# Altium schematic sheet CarrierConnector.SchDoc
size A4; CompanyName: Technische Hochschule Nürnberg Georg Simon Ohm; Organization: UltraZohm; Address1: Kesslerplatz 12; Address2: 90489 Nürnberg; Address3: GERMANY; DocumentNumber: 2; SheetNumber: 2; SheetTotal: 5; Website: www.ultrazohm.com
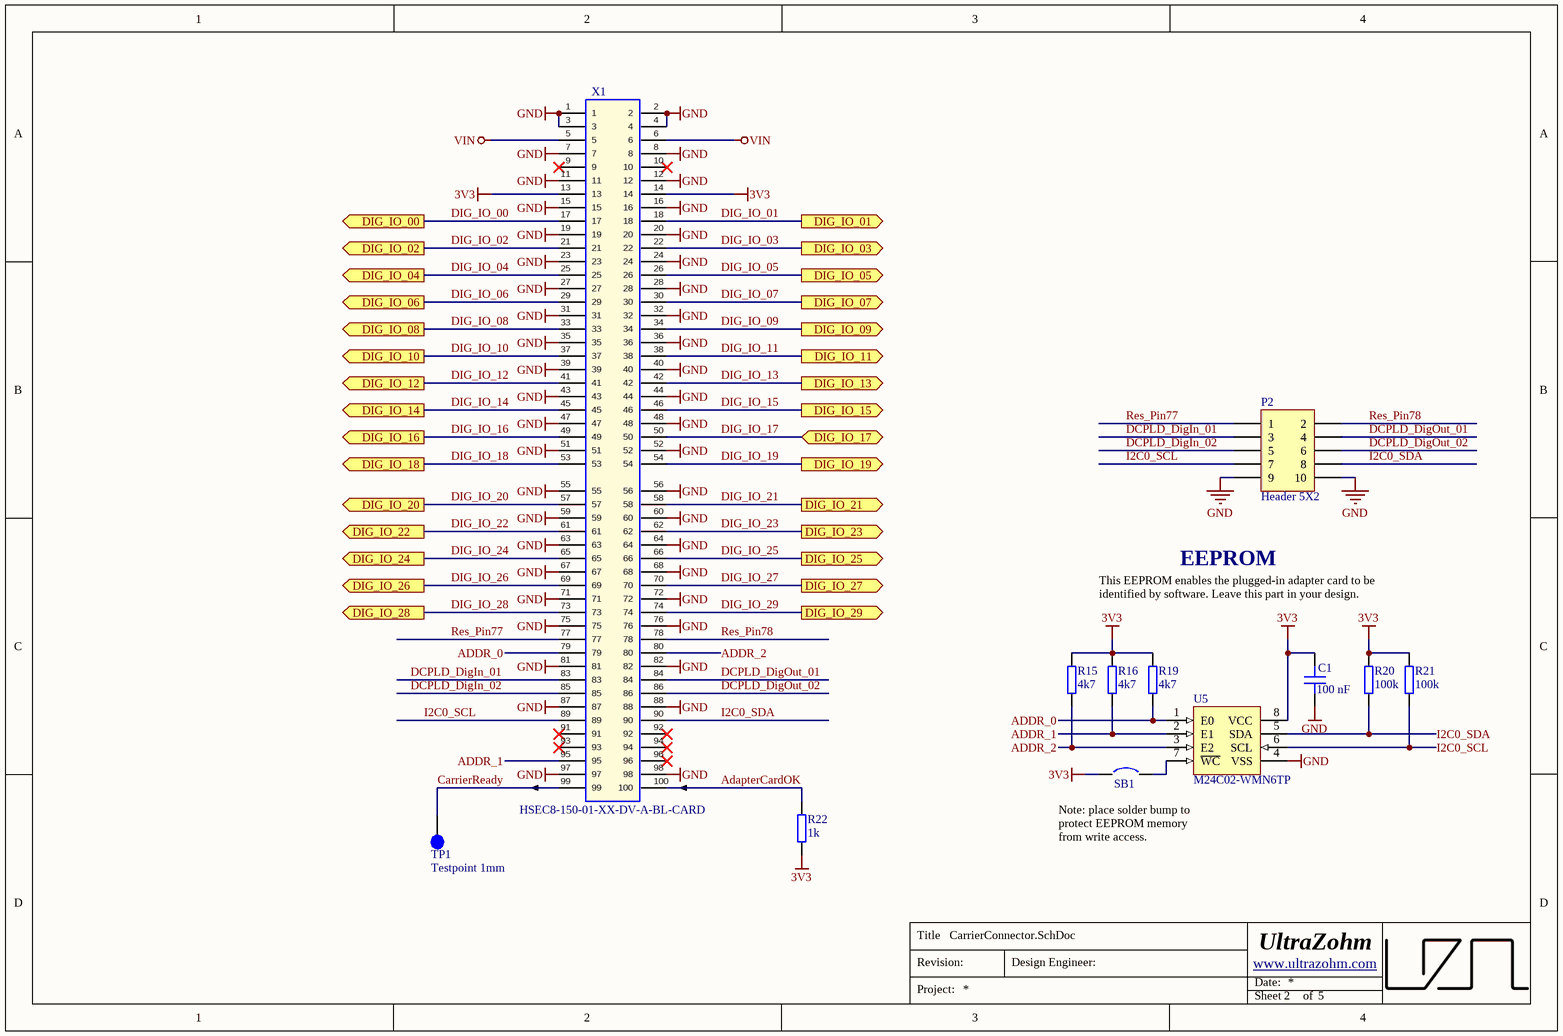
[diagram p0: CarrierConnector.SchDoc]

## Parts
C1  100 nF  [C_0603]
P2  Header 5X2  [HDR2X5]
R15  4k7  [RES 0603_1608]
R16  4k7  [RES 0603_1608]
R19  4k7  [RES 0603_1608]
R20  100k  [RES 0603_1608]
R21  100k  [RES 0603_1608]
R22  1k  [R_0603_TE]
SB1  Solder Bump 0603  [SB_0603]  (value not drawn)  (no BOM)
TP1  Testpoint 1mm  [TP_1mm]  (no BOM)
U5  M24C02-WMN6TP  [D0008A_N]
X1  HSEC8-150-01-XX-DV-A-BL-CARD  [HSEC8-150-01-XX-DV-A-BL-CARD]  (no BOM)

## Ports
DIG_IO_00 (out), DIG_IO_01 (out), DIG_IO_02 (out), DIG_IO_03 (out), DIG_IO_04 (out), DIG_IO_05 (out), DIG_IO_06 (out), DIG_IO_07 (out), DIG_IO_08 (out), DIG_IO_09 (out), DIG_IO_10 (out), DIG_IO_11 (out), DIG_IO_12 (out), DIG_IO_13 (out), DIG_IO_14 (out), DIG_IO_15 (out), DIG_IO_16 (out), DIG_IO_17 (bidir), DIG_IO_18 (out), DIG_IO_19 (out), DIG_IO_20 (out), DIG_IO_21 (out), DIG_IO_22 (out), DIG_IO_23 (out), DIG_IO_24 (out), DIG_IO_25 (out), DIG_IO_26 (out), DIG_IO_27 (out), DIG_IO_28 (out), DIG_IO_29 (out)

## Nets
3V3: C1.1 R15.2 R16.2 R19.2 R20.2 R21.2 R22.1 SB1.1 U5.8(VCC) X1.13 X1.14
GND: C1.2 P2.9 P2.10 U5.4(VSS) X1.1 X1.2 X1.3 X1.4 X1.7 X1.8 X1.11 X1.12 X1.15 X1.16 X1.19 X1.20 X1.23 X1.24 X1.27 X1.28 X1.31 X1.32 X1.35 X1.36 X1.39 X1.40 X1.43 X1.44 X1.47 X1.48 X1.51 X1.52 X1.55 X1.56 X1.59 X1.60 X1.63 X1.64 X1.67 X1.68 X1.71 X1.72 X1.75 X1.76 X1.81 X1.82 X1.87 X1.88 X1.97 X1.98
VIN: X1.5 X1.6
AdapterCardOK: R22.2 X1.100
ADDR_0: R19.1 U5.1(E0) X1.79
ADDR_1: R16.1 U5.2(E1) X1.95
ADDR_2: R15.1 U5.3(E2) X1.80
CarrierReady: TP1.1 X1.99
DCPLD_DigIn_01: P2.3 X1.83
DCPLD_DigIn_02: P2.5 X1.85
DCPLD_DigOut_01: P2.4 X1.84
DCPLD_DigOut_02: P2.6 X1.86
DIG_IO_00: X1.17 ; port DIG_IO_00
DIG_IO_01: X1.18 ; port DIG_IO_01
DIG_IO_02: X1.21 ; port DIG_IO_02
DIG_IO_03: X1.22 ; port DIG_IO_03
DIG_IO_04: X1.25 ; port DIG_IO_04
DIG_IO_05: X1.26 ; port DIG_IO_05
DIG_IO_06: X1.29 ; port DIG_IO_06
DIG_IO_07: X1.30 ; port DIG_IO_07
DIG_IO_08: X1.33 ; port DIG_IO_08
DIG_IO_09: X1.34 ; port DIG_IO_09
DIG_IO_10: X1.37 ; port DIG_IO_10
DIG_IO_11: X1.38 ; port DIG_IO_11
DIG_IO_12: X1.41 ; port DIG_IO_12
DIG_IO_13: X1.42 ; port DIG_IO_13
DIG_IO_14: X1.45 ; port DIG_IO_14
DIG_IO_15: X1.46 ; port DIG_IO_15
DIG_IO_16: X1.49 ; port DIG_IO_16
DIG_IO_17: X1.50 ; port DIG_IO_17
DIG_IO_18: X1.53 ; port DIG_IO_18
DIG_IO_19: X1.54 ; port DIG_IO_19
DIG_IO_20: X1.57 ; port DIG_IO_20
DIG_IO_21: X1.58 ; port DIG_IO_21
DIG_IO_22: X1.61 ; port DIG_IO_22
DIG_IO_23: X1.62 ; port DIG_IO_23
DIG_IO_24: X1.65 ; port DIG_IO_24
DIG_IO_25: X1.66 ; port DIG_IO_25
DIG_IO_26: X1.69 ; port DIG_IO_26
DIG_IO_27: X1.70 ; port DIG_IO_27
DIG_IO_28: X1.73 ; port DIG_IO_28
DIG_IO_29: X1.74 ; port DIG_IO_29
I2C0_SCL: P2.7 R21.1 U5.6(SCL) X1.89
I2C0_SDA: P2.8 R20.1 U5.5(SDA) X1.90
Res_Pin77: P2.1 X1.77
Res_Pin78: P2.2 X1.78
NetSB1_2: SB1.2 U5.7(~{WC})

Not connected (* = marked no-connect by the designer): X1 9* 10* 91* 92* 93* 94* 96*

## Notes on the sheet
- EEPROM
- This EEPROM enables the plugged-in adapter card to be identified by software. Leave this part in your design.
- Note: place solder bump to protect EEPROM memory from write access.
- Title
- Revision:
- Design Engineer:
- Date:
- Project:
- Sheet
- of

## Library data of the parts
C1 = C0603C104K9PACTU: Capacitor 0603, 6.3 VDC, 100 nF, X5R; Manufacturer: KEMET; Tolerance: 10 %; Voltage Rating: 6.3 VDC; Created from: MGremer; Manufacturer Part Number: C0603C104K9PACTU; PartID: 70; Created On: 20.12.2020 13:54:13; ComponentLink1Description: Datasheet; ComponentLink1URL: https://www.mouser.de/datasheet/2/212/KEM_C1006_X5R_SMD-1103249.pdf; Component Type: Capacitor 0603; Device Package: 0603; Last Updated: 20.01.2021 13:57:36; Mounting Type: SMD; Operating Temperature: -55 - 85°C; Series: SMD Comm X5R; Supplier 1: Mouser; Supplier Part Number 1: 80-C0603C104K9P; Type: Capacitor; Value: 100 nF; Live Cycle Status: 1; Stock number: not stored
P2 = Header 5X2: Header, 5-Pin, Dual row; LatestRevisionDate: 17-Jul-2002; LatestRevisionNote: Re-released for DXP Platform.; Publisher: Altium Limited
R15 R16 R19 = 0603WAF4701T5E: SMD resistor E24 series; Manufacturer: UNI-ROYAL; Tolerance: 1%; Created from: AGeiger; Manufacturer Part Number: 0603WAF4701T5E; PartID: 90; Created On: 14.12.2020 16:17:14; ComponentLink1Description: Datasheet; ComponentLink1URL: https://datasheet.lcsc.com/lcsc/2206010116_UNI-ROYAL-Uniroyal-Elec-0603WAF4701T5E_C23162.pdf; Component Type: SMD resistor; Device Package: 0603; Last Updated: 25.08.2022 20:03:04; Mounting Type: SMD; Supplier 1: LCSC; Supplier Part Number 1: C23162; Type: Resistor; Value: 4k7; Live Cycle Status: 1; Stock number: Labor SMD Container; LCSC Part Number: C23162
R20 R21 = RK73B1JTTD104J: SMD resistor E24 series; Manufacturer: KOA Speer; Tolerance: 5%; Created from: MGremer; Manufacturer Part Number: RK73B1JTTD104J; PartID: 122; Created On: 14.12.2020 16:17:14; ComponentLink1Description: Datasheet; ComponentLink1URL: https://www.mouser.de/datasheet/2/219/RK73B-1825463.pdf; Component Type: SMD resistor; Device Package: 0603; Last Updated: 27.05.2022 14:04:10; Mounting Type: SMD; Supplier 1: Mouser; Supplier Part Number 1: 660-RK73B1JTTD104J; Type: Resistor; Value: 100k; Live Cycle Status: 1; Stock number: Labor SMD Container; LCSC Part Number: C25803
R22 = UZgen_R_0603_1k: Generic resistor; Manufacturer: UZgen; Tolerance: 1 %; Created from: UZgenTool; Manufacturer Part Number: UZgen_R_0603_1k; PartID: 221; Created On: 02.07.2024 17:29:49; Value: 1k; Device Package: 0603; Mounting Type: SMD; Last Updated: 02.07.2024 17:29:49
SB1 = =Value: Created from: AGeiger; Revision: July-2002: Re-released for DXP Platform.; PartID: 1; Created On: 09.01.2024 17:13:56; Component Type: Solder Bump; Device Package: 0603; Last Updated: 09.01.2024 17:13:56; Manufacturer Part Number: Solder Bump 0603; Mounting Type: SMD; Value: Solder Bump 0603
TP1 = NULL: Manufacturer Part Number: NULL; Created from: AGeiger; Created: 2018_06_25_AGeiger; Value: Testpoint 1mm; PartID: 9; Created On: 20.09.2022 13:14:57; Component Type: Testpoint; Last Updated: 20.09.2022 13:15:39; Manufacturer: NULL; Supplier 1: NULL; Supplier Part Number 1: NULL; Type: Testpoint; Live Cycle Status: 1
U5 = M24C02-WMN6TP: 2Kbit I2C SOP-8 EEPROM ROHS; Manufacturer: STMicroelectronics; Created from: AGeiger; Manufacturer Part Number: M24C02-WMN6TP; PartID: 1; Created On: 19.11.2023 14:54:27; ComponentLink1Description: Datasheet; ComponentLink1URL: https://www.st.com/resource/en/datasheet/m24c01-w.pdf; Component Type: EEPROM; Device Package: SOIC-8; Last Updated: 19.11.2023 21:39:04; Mounting Type: SMD; Operating Temperature: -40 to +85 °C; Series: M24xxx; Supplier 1: Mouser; Supplier Part Number 1: 511-M24C02-WMN6TP; Supplier 2: LCSC; Supplier Part Number 2: C7562; Type: Memory; Value: M24C02-WMN6TP; LCSC Part Number: C7562
X1 = HSEC8-150-01-XX-DV-A-BL-CARD: Mating Card Layout for HSEC8-150-01-XX-DV-A-BL; Manufacturer: SAMTEC; Created: 2018_04_23_AGeiger; Value: HSEC8-150-01-XX-DV-A-BL-CARD